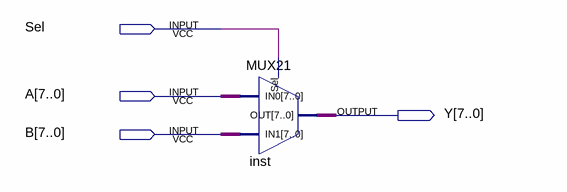
[diagram p0: schematic sheet]
// Quartus schematic TEST_COMP.bdf as structural Verilog: 1 symbols, 4 pins
module TEST_COMP (
  input  Sel,
  input  [7:0] A,
  input  [7:0] B,
  output [7:0] Y
);

  MUX21 inst (.Sel(Sel), .IN0(A), .IN1(B), .OUT(Y));
endmodule
